# EAGLE schematic ACM_WorkingPrototype130119 (EAGLE 9.2.1)
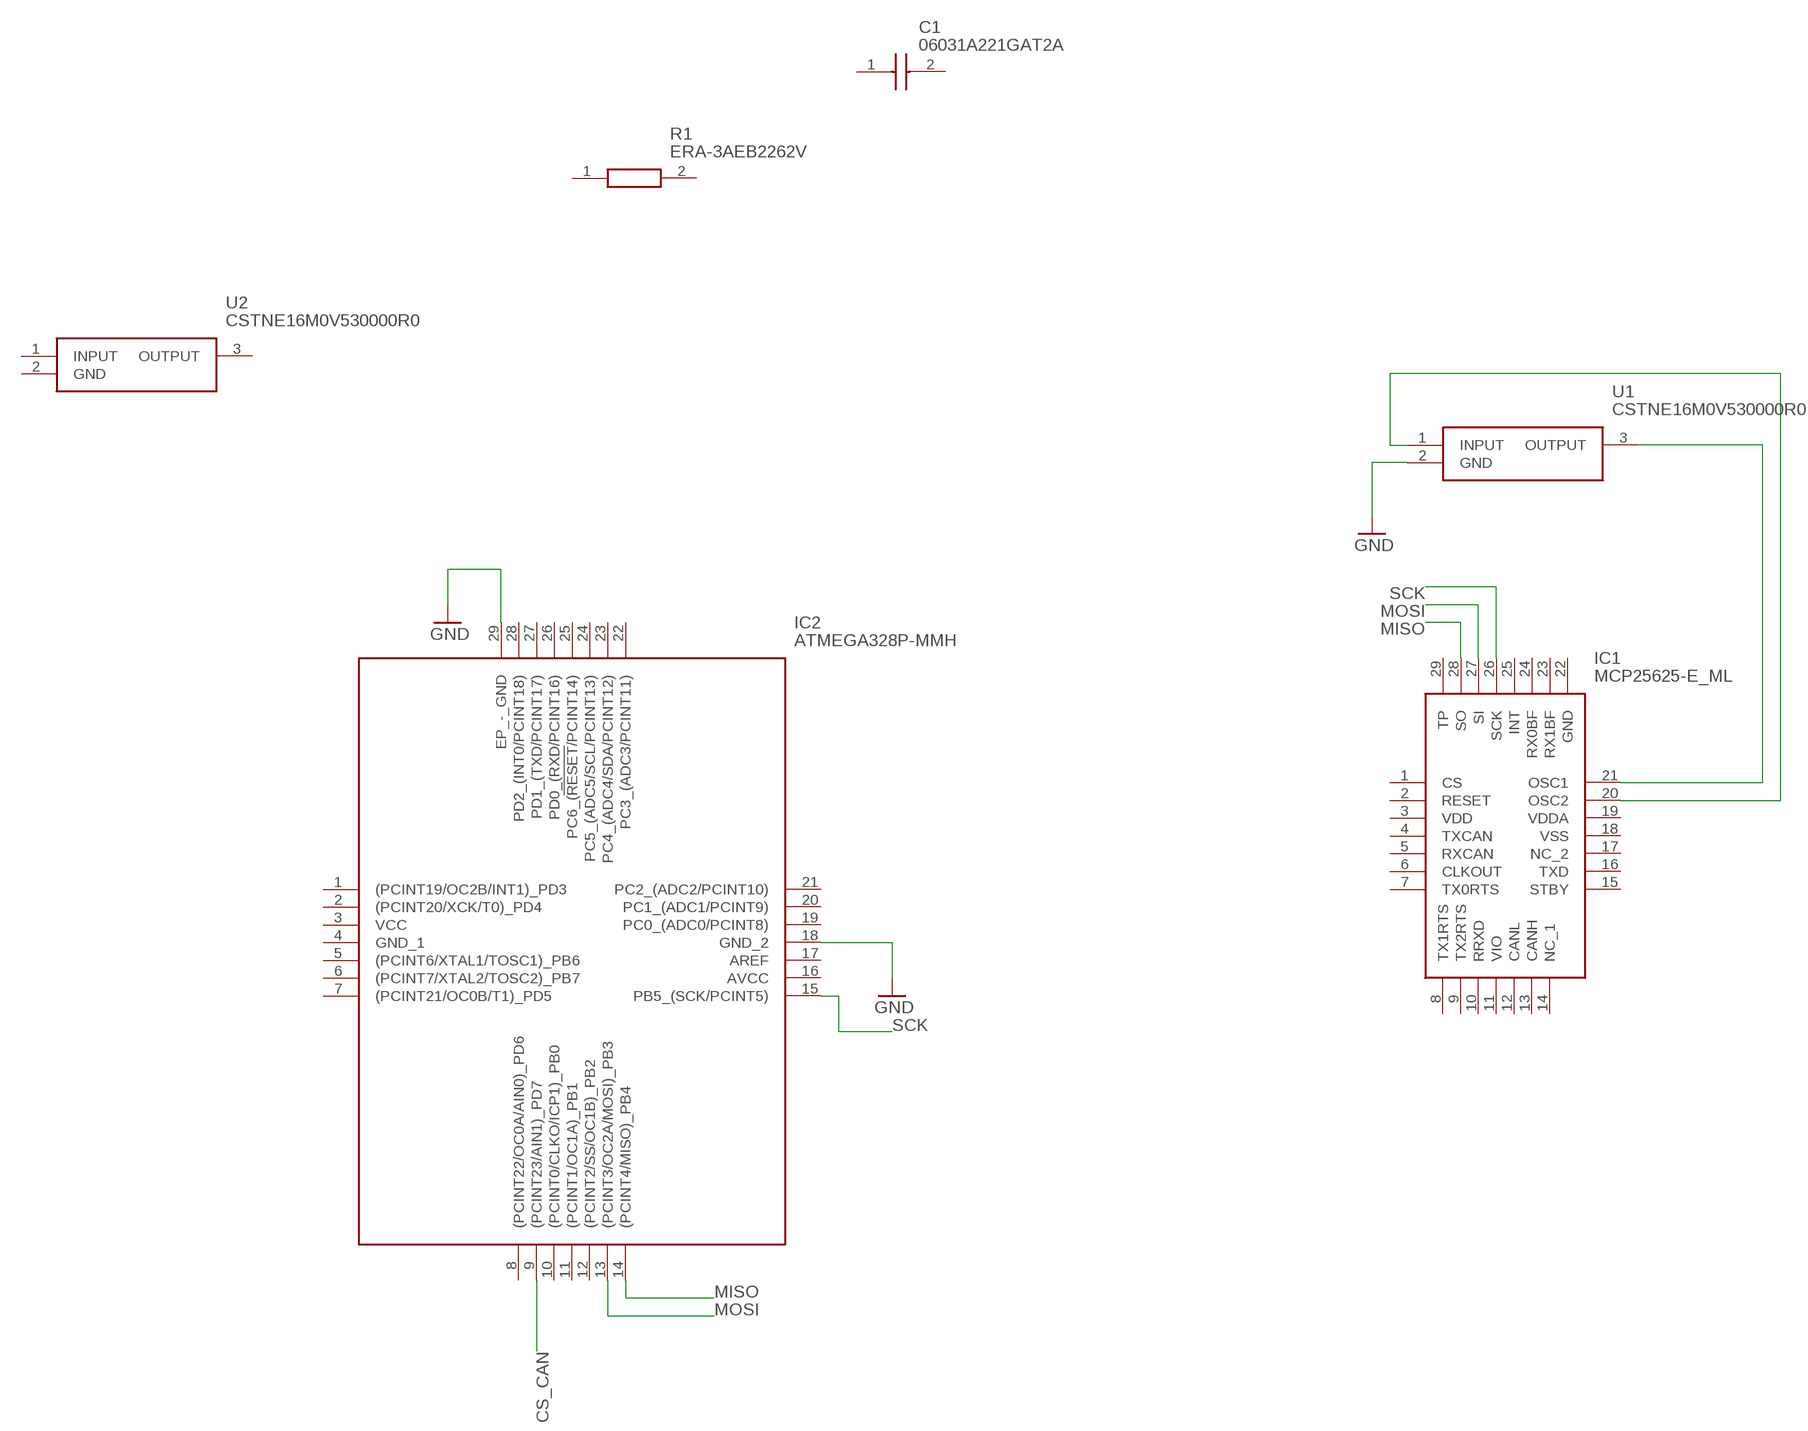
[diagram p0: schematic, sheet 1]

## Parts
C1  06031A221GAT2A  [CAPC1608X90N]
IC1  MCP25625-E_ML  [QFN65P600X600X100-29N]
IC2  ATMEGA328P-MMH  [QFN45P400X400X100-29N]
R1  ERA-3AEB2262V  [RESC1608X55N]
U1  CSTNE16M0V530000R0  [CSTNE16M0V530000R0]
U2  CSTNE16M0V530000R0  [CSTNE16M0V530000R0]

## Nets
CS_CAN: IC2.9((PCINT23/AIN1)_PD7)
GND: IC2.18(GND_2) IC2.29(EP_-_GND) U1.2(GND)
MISO: IC1.28(SO) IC2.14((PCINT4/MISO)_PB4)
MOSI: IC1.27(SI) IC2.13((PCINT3/OC2A/MOSI)_PB3)
N$2: IC1.21(OSC1) U1.3(OUTPUT)
N$3: IC1.20(OSC2) U1.1(INPUT)
SCK: IC1.26(SCK) IC2.15(PB5_(SCK/PCINT5))
Unconnected: C1.1 C1.2 IC1.1(CS) IC1.2(RESET) IC1.4(TXCAN) IC1.5(RXCAN) IC1.6(CLKOUT) IC1.7(TX0RTS) IC1.8(TX1RTS) IC1.9(TX2RTS) IC1.10(RRXD) IC1.11(VIO) IC1.12(CANL) IC1.13(CANH) IC1.14(NC_1) IC1.15(STBY) IC1.16(TXD) IC1.17(NC_2) IC1.23(RX1BF) IC1.24(RX0BF) IC1.25(INT) IC1.29(TP) IC2.1((PCINT19/OC2B/INT1)_PD3) IC2.2((PCINT20/XCK/T0)_PD4) IC2.3(VCC) IC2.4(GND_1) IC2.5((PCINT6/XTAL1/TOSC1)_PB6) IC2.6((PCINT7/XTAL2/TOSC2)_PB7) IC2.7((PCINT21/OC0B/T1)_PD5) IC2.8((PCINT22/OC0A/AIN0)_PD6) IC2.10((PCINT0/CLKO/ICP1)_PB0) IC2.11((PCINT1/OC1A)_PB1) IC2.12((PCINT2/SS/OC1B)_PB2) IC2.16(AVCC) IC2.17(AREF) IC2.19(PC0_(ADC0/PCINT8)) IC2.20(PC1_(ADC1/PCINT9)) IC2.21(PC2_(ADC2/PCINT10)) IC2.22(PC3_(ADC3/PCINT11)) IC2.23(PC4_(ADC4/SDA/PCINT12)) IC2.24(PC5_(ADC5/SCL/PCINT13)) IC2.25(PC6_(!RESET!/PCINT14)) IC2.26(PD0_(RXD/PCINT16)) IC2.27(PD1_(TXD/PCINT17)) IC2.28(PD2_(INT0/PCINT18)) R1.1 R1.2 U2.1(INPUT) U2.2(GND) U2.3(OUTPUT)

## Power pins joined to a net without a drawn wire
GND: IC1.22(GND)
VDD: IC1.3(VDD)
VDDA: IC1.19(VDDA)
VSS: IC1.18(VSS)

## Library data of the parts
C1 = 06031A221GAT2A(0603 Capacitor):06031A221GAT2A: Multilayer Ceramic Capacitors MLCC - SMD/SMT 100V 220pF C0G 0603 2% Tol Source: Datasheet <https://componentsearchengine.com/Datasheets/1/06031A100FAT2A.pdf>; DESCRIPTION: Multilayer Ceramic Capacitors MLCC - SMD/SMT 100V 220pF C0G 0603 2% Tol; HEIGHT: 0.9mm; MANUFACTURER_NAME: AVX; MANUFACTURER_PART_NUMBER: 06031A221GAT2A; MOUSER_PART_NUMBER: 581-06031A221GAT2A; MOUSER_PRICE-STOCK: https://www.mouser.com/Search/Refine.aspx?Keyword=581-06031A221GAT2A
IC1 = MCP25625-E_ML:MCP25625-E_ML: CAN Controller with Transceiver QFN28 Microchip MCP25625-E/ML, CAN Controller, 28-Pin QFN Source: Datasheet <http://docs-europe.electrocomponents.com/webdocs/137c/0900766b8137cddf.pdf>; ALLIED_NUMBER: 70431541; ALLIED_PRICE-STOCK: http://www.alliedelec.com/microchip-technology-inc-mcp25625-e-ml/70431541/; ARROW_PART_NUMBER: MCP25625-E/ML; ARROW_PRICE-STOCK: https://www.arrow.com/en/products/mcp25625-eml/microchip-technology; DESCRIPTION: CAN Controller with Transceiver QFN28 Microchip MCP25625-E/ML, CAN Controller, 28-Pin QFN; HEIGHT: 1mm; MANUFACTURER_NAME: Microchip; MANUFACTURER_PART_NUMBER: MCP25625-E/ML; RS_PART_NUMBER: 1654104; RS_PRICE-STOCK: http://uk.rs-online.com/web/p/products/1654104
IC2 = ATMEGA328P-MMH:ATMEGA328P-MMH: Atmel ATMEGA328P-MMH, 8bit AVR Microcontroller, 20MHz, 32 kB Flash, 28-Pin QFN Source: Datasheet <http://uk.rs-online.com/web/p/products/8149138P>; ARROW_PART_NUMBER: ATMEGA328P-MMH; ARROW_PRICE-STOCK: https://www.arrow.com/en/products/atmega328p-mmh/microchip-technology; DESCRIPTION: Atmel ATMEGA328P-MMH, 8bit AVR Microcontroller, 20MHz, 32 kB Flash, 28-Pin QFN; HEIGHT: 1mm; MANUFACTURER_NAME: Microchip; MANUFACTURER_PART_NUMBER: ATMEGA328P-MMH; RS_PART_NUMBER: 1310272P; RS_PRICE-STOCK: http://uk.rs-online.com/web/p/products/1310272P
R1 = ERA-3AEB2262V(0603 Resistor):ERA-3AEB2262V: Thin Film Resistors - SMD 0603 22.6Kohm 0.1% 25ppm Source: Datasheet <https://industrial.panasonic.com/cdbs/www-data/pdf/RDA0000/AOA0000C237.pdf>; DESCRIPTION: Thin Film Resistors - SMD 0603 22.6Kohm 0.1% 25ppm; HEIGHT: 0.55mm; MANUFACTURER_NAME: Panasonic; MANUFACTURER_PART_NUMBER: ERA-3AEB2262V; MOUSER_PART_NUMBER: 667-ERA-3AEB2262V; MOUSER_PRICE-STOCK: https://www.mouser.com/Search/Refine.aspx?Keyword=667-ERA-3AEB2262V
U1 U2 = CSTNE16M0V530000R0 (Resonator):CSTNE16M0V530000R0: Resonators 16.0000MHz 15pF SMD CHP Resntr Source: Datasheet <https://www.murata.com/en-eu/products/productdata/8801162231838/SPEC-CSTNE16M0V530000R0.pdf?1519875007000>; ARROW_PART_NUMBER: CSTNE16M0V530000R0; ARROW_PRICE-STOCK: https://www.arrow.com/en/products/cstne16m0v530000r0/murata-manufacturing; DESCRIPTION: Resonators 16.0000MHz 15pF SMD CHP Resntr; HEIGHT: 1mm; MANUFACTURER_NAME: Murata Electronics; MANUFACTURER_PART_NUMBER: CSTNE16M0V530000R0